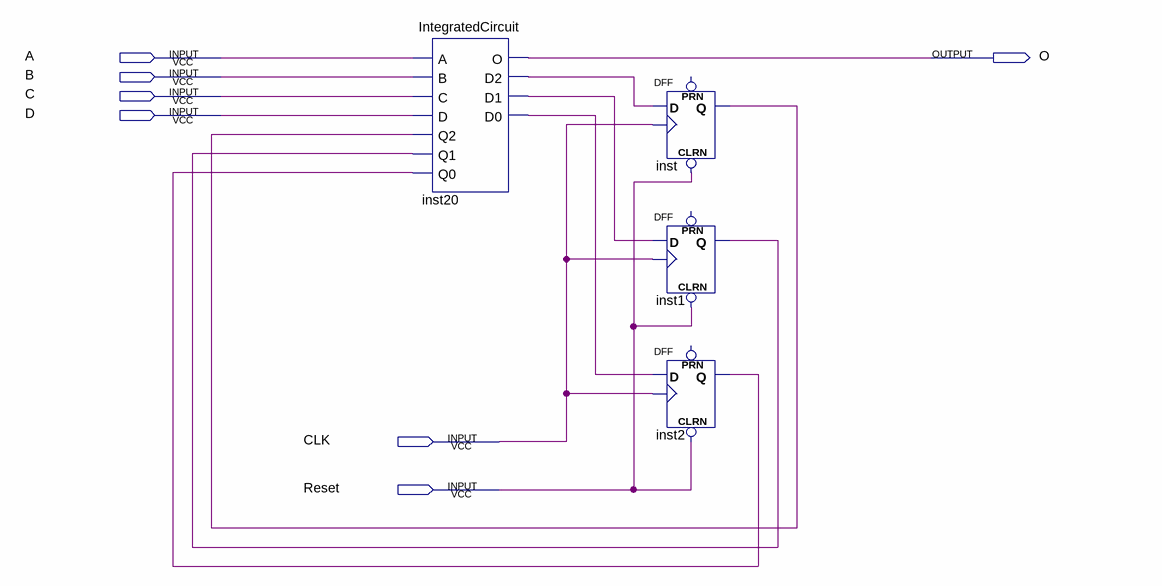
[diagram p0: schematic sheet]
// Quartus schematic LAB2_BTthem.bdf as structural Verilog: 4 symbols, 7 pins
module LAB2_BTthem (
  input  A,
  input  B,
  input  C,
  input  D,
  input  CLK,
  input  Reset,
  output O
);

  wire inst1_q, inst2_q, inst20_d0, inst20_d1, inst20_d2, inst_q;

  IntegratedCircuit inst20 (
    .A(A), .B(B), .C(C), .D(D), .Q2(inst_q), .Q1(inst1_q), .Q0(inst2_q), .O(O), .D2(inst20_d2),
    .D1(inst20_d1), .D0(inst20_d0));
  DFF inst (.CLRN(Reset), .CLK(CLK), .D(inst20_d2), .Q(inst_q));  // open: PRN
  DFF inst1 (.CLRN(Reset), .CLK(CLK), .D(inst20_d1), .Q(inst1_q));  // open: PRN
  DFF inst2 (.CLRN(Reset), .CLK(CLK), .D(inst20_d0), .Q(inst2_q));  // open: PRN
endmodule
